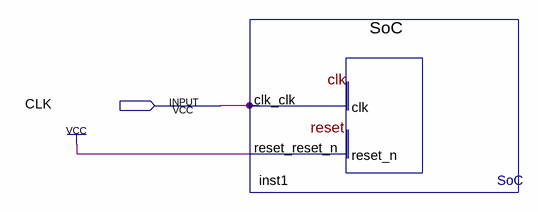
[diagram p0: schematic sheet]
// Quartus schematic TopLevel.bdf as structural Verilog: 1 symbols, 1 pins
module TopLevel (
  input  CLK
);

  SoC inst1 (.clk_clk(CLK), .reset_reset_n(1'b1));
endmodule
